# Altium schematic sheet PAGE1 - MAIN.SchDoc
size A3; DocumentNumber: 1; SheetNumber: 1; SheetTotal: 2
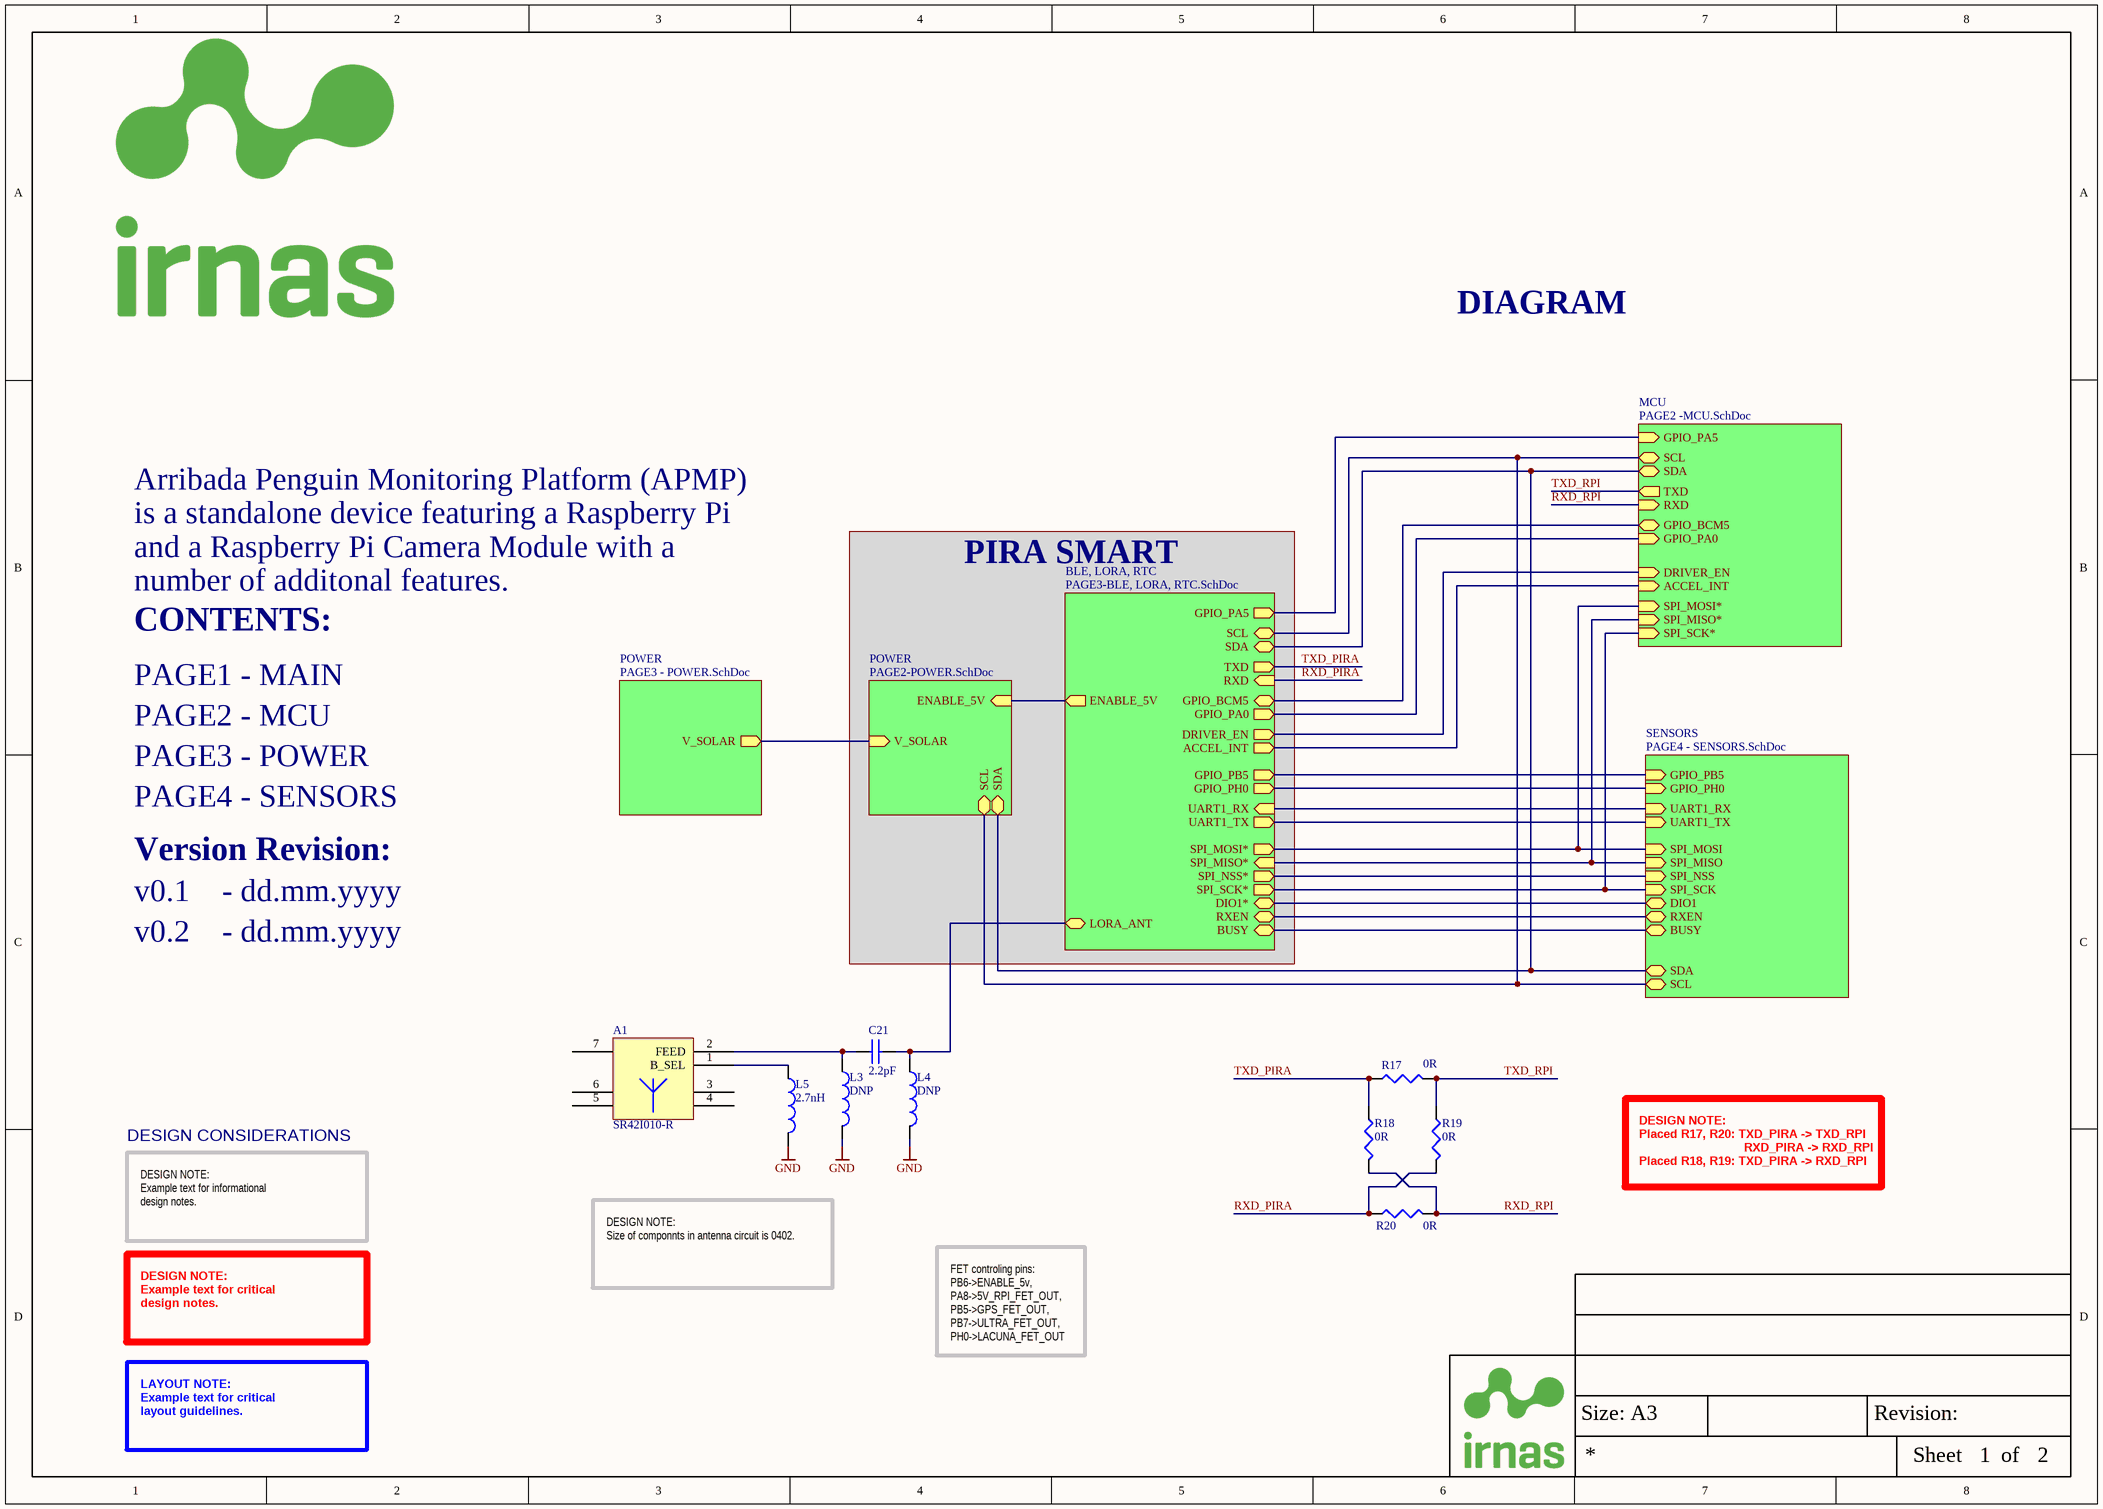
[diagram p0: PAGE1 - MAIN.SchDoc]

## Parts
A1  SR42I010-R  [LORA_PCB_ANTENNA]
C21  2.2pF  [CAP0402]
L3  DNP  [IND0402]
L4  DNP  [IND0402]
L5  2.7nH  [IND0402]
R17  0R  [RES0603]
R18  0R  [RES0603]
R19  0R  [RES0603]
R20  0R  [RES0603]

## Sub-sheets
BLE, LORA, RTC = PAGE3-BLE, LORA, RTC.SchDoc: ENABLE_5V (out), SDA (bidir), UART1_RX (in), SCL (bidir), UART1_TX (out), GPIO_PH0 (out), GPIO_PA5 (out), LORA_ANT (bidir), GPIO_PB5 (out), SPI_MOSI* (out), SPI_MISO* (in), SPI_SCK* (out), DIO1* (bidir), SPI_NSS* (out), TXD (out), RXD (in), GPIO_BCM5 (bidir), RXEN (bidir), BUSY (bidir), GPIO_PA0 (out), DRIVER_EN (out), ACCEL_INT (out)
MCU = PAGE2 -MCU.SchDoc: SDA (bidir), GPIO_PA5 (in), SCL (bidir), TXD (out), GPIO_BCM5 (bidir), RXD (in), GPIO_PA0 (in), DRIVER_EN (in), ACCEL_INT (in), SPI_MISO* (in), SPI_MOSI* (in), SPI_SCK* (in)
POWER = PAGE3 - POWER.SchDoc: V_SOLAR (out)
POWER = PAGE2-POWER.SchDoc: ENABLE_5V (in), SCL (bidir), SDA (bidir), V_SOLAR (in)
SENSORS = PAGE4 - SENSORS.SchDoc: SDA (bidir), GPIO_PH0 (in), UART1_RX (in), SPI_SCK (in), SPI_NSS (in), UART1_TX (in), SCL (bidir), GPIO_PB5 (in), DIO1 (bidir), SPI_MISO (in), SPI_MOSI (in), RXEN (bidir), BUSY (bidir)

## Nets
GND: L3.1 L4.1 L5.1
RXD_PIRA: R19.2 R20.1 ; sheet BLE, LORA, RTC/RXD
RXD_RPI: R18.2 R20.2 ; sheet MCU/RXD
TXD_PIRA: R17.1 R18.1 ; sheet BLE, LORA, RTC/TXD
TXD_RPI: R17.2 R19.1 ; sheet MCU/TXD
NetA1_1: A1.1(B_SEL) L5.2
NetA1_2: A1.2(FEED) C21.1 L3.2
NetC21_2: C21.2 L4.2 ; sheet BLE, LORA, RTC/LORA_ANT
(unnamed): sheet POWER/V_SOLAR, sheet POWER/V_SOLAR
(unnamed): sheet SENSORS/SDA, sheet MCU/SDA, sheet POWER/SDA, sheet BLE, LORA, RTC/SDA
(unnamed): sheet SENSORS/GPIO_PH0, sheet BLE, LORA, RTC/GPIO_PH0
(unnamed): sheet SENSORS/UART1_RX, sheet BLE, LORA, RTC/UART1_RX
(unnamed): sheet SENSORS/SPI_SCK, sheet MCU/SPI_SCK*, sheet BLE, LORA, RTC/SPI_SCK*
(unnamed): sheet SENSORS/SPI_NSS, sheet BLE, LORA, RTC/SPI_NSS*
(unnamed): sheet SENSORS/UART1_TX, sheet BLE, LORA, RTC/UART1_TX
(unnamed): sheet SENSORS/SCL, sheet MCU/SCL, sheet POWER/SCL, sheet BLE, LORA, RTC/SCL
(unnamed): sheet SENSORS/GPIO_PB5, sheet BLE, LORA, RTC/GPIO_PB5
(unnamed): sheet SENSORS/DIO1, sheet BLE, LORA, RTC/DIO1*
(unnamed): sheet SENSORS/SPI_MISO, sheet MCU/SPI_MISO*, sheet BLE, LORA, RTC/SPI_MISO*
(unnamed): sheet SENSORS/SPI_MOSI, sheet MCU/SPI_MOSI*, sheet BLE, LORA, RTC/SPI_MOSI*
(unnamed): sheet SENSORS/RXEN, sheet BLE, LORA, RTC/RXEN
(unnamed): sheet SENSORS/BUSY, sheet BLE, LORA, RTC/BUSY
(unnamed): sheet MCU/GPIO_PA5, sheet BLE, LORA, RTC/GPIO_PA5
(unnamed): sheet MCU/GPIO_BCM5, sheet BLE, LORA, RTC/GPIO_BCM5
(unnamed): sheet MCU/GPIO_PA0, sheet BLE, LORA, RTC/GPIO_PA0
(unnamed): sheet MCU/DRIVER_EN, sheet BLE, LORA, RTC/DRIVER_EN
(unnamed): sheet MCU/ACCEL_INT, sheet BLE, LORA, RTC/ACCEL_INT
(unnamed): sheet POWER/ENABLE_5V, sheet BLE, LORA, RTC/ENABLE_5V

Not connected (* = marked no-connect by the designer): A1 3 4 5 6 7

## Notes on the sheet
- DIAGRAM
- Arribada Penguin Monitoring Platform (APMP)
- is a standalone device featuring a Raspberry Pi
- and a Raspberry Pi Camera Module with a
- PIRA SMART
- CONTENTS:
- number of additonal features.
- PAGE1 - MAIN
- PAGE2 - MCU
- PAGE3 - POWER
- PAGE4 - SENSORS
- Version Revision:
- v0.1    - dd.mm.yyyy
- v0.2    - dd.mm.yyyy
- DESIGN CONSIDERATIONS
- DESIGN NOTE:
  Placed R17, R20: TXD_PIRA -> TXD_RPI
  RXD_PIRA -> RXD_RPI
  Placed R18, R19: TXD_PIRA -> RXD_RPI
  RXD_PIRA -> TXD_RPI
- DESIGN NOTE:
  Example text for informational
  design notes.
- DESIGN NOTE:
  Example text for critical
  design notes.
- DESIGN NOTE:
  Size of componnts in antenna circuit is 0402.
- FET controling pins:
  PB6->ENABLE_5v,
  PA8->5V_RPI_FET_OUT,
  PB5->GPS_FET_OUT,
  PB7->ULTRA_FET_OUT,
  PH0->LACUNA_FET_OUT
- LAYOUT NOTE:
  Example text for critical
  layout guidelines.
- Size: A3
- Revision:
- Sheet
- of

## Library data of the parts
A1 = ANT - SR42I010-R_1: Antenna SMD -4dBi Gain 870MHz/928MHz Automotive 7-Pin SMD T/R; Manufacturer: Antenova; Supplier 1: Mouser; Manufacturer Part Number: SR42I010-R; Stock 1: 3154; Pricing 1: 1 = 2.36000, 10 = 1.90000, 50 = 1.90000, 100 = 1.52000, 1000 = 1.07000, 10000 = 0.95900 (USD); Supplier Part Number 1: 237-SR42I010-R
C21 = C - 1.8pF/0402: Multilayer Ceramic Capacitors MLCC - SMD/SMT 50volts 1.8pF C0G; Manufacturer: KEMET; Manufacturer Part Number: C0402C189B5GACTU; IRNAS Part No.: /; Voltage Rating: 50V; Stock 1: 8950; Pricing 1: 10=0.463, 100=0.248, 500=0.182, 2500=0.153, 5000=0.134, 10000=0.11, 50000=0.0961 (EUR); Case/Package: 0402; Case Code (Imperial): 0402; Case Code (Metric): 1005; Dielectric Material: Ceramic; Min Operating Temperature: -55°C; Max Operating Temperature: 125°C; Packaging: Tape and Reel; Voltage Rating (DC): 50V; Capacitance: 1.8pF; Termination: SMD/SMT; Lead Free: Lead Free; ComponentLink1URL: https://datasheet.ciiva.com/5413/kem-c1003-c0g-smd-5413366.pdf; ComponentLink1Description: https://datasheet.ciiva.com/5413/kem-c1003-c0g-smd-5413366.pdf; Supplier 1: Farnell; Supplier Part Number 1: 2627398
L3-L5 = L - 4.3nH/0402: Inductor RF Chip Multi-Layer 4.3nH 0.3nH 100MHz 8Q-Factor Air 300mA 210mOhm DCR 0402 Paper T/R; Manufacturer: Murata; Manufacturer Part Number: LQG15HN4N3S02D; IRNAS Part No.: /; Q Factor: 8; Self Resonant Frequency: 6GHz; Shielding: Unshielded; DC Resistance (DCR): 210mR; Stock 1: 3502; Pricing 1: 1 = 0.10000, 10 = 0.06100, 100 = 0.04040, 500 = 0.03366, 1000 = 0.02827, 2500 = 0.02423 (USD); RoHS: Yes; Mount: Surface Mount; Case/Package: 0402; Core Material: Air; Case Code (Metric): 1005; Case Code (Imperial): 0402; Min Operating Temperature: -55°C; Max Operating Temperature: 125°C; Package Quantity: 10000; Packaging: Tape and Reel; Current Rating: 300mA; Inductance: 4.3nh; Test Frequency: 100MHz; Max DC Current: 300mA; Termination: SMD/SMT; Current: 300mA; DC Current: 300mA; Military Standard: Not; Length: 1.05mm; Height: 0.5mm; Width: 0.02inch; Height - Seated (Max): 0.022inch; Depth: 0.55mm; Radiation Hardening: No; REACH SVHC: No SVHC; Lead Free: Lead Free; ComponentLink1URL: http://uk.rs-online.com/webdocs/0f10/0900766b80f10808.pdf?src-supplier=RSComponents; ComponentLink1Description: http://uk.rs-online.com/webdocs/0f10/0900766b80f10808.pdf?src-supplier=RSComponents; ComponentLink2URL: http://search.murata.co.jp/Ceramy/image/img/PDF/ENG/L0075S0083LQG15HN.pdf?src-supplier=Avnet; ComponentLink2Description: http://search.murata.co.jp/Ceramy/image/img/PDF/ENG/L0075S0083LQG15HN.pdf?src-supplier=Avnet; ComponentLink3URL: http://www.farnell.com/datasheets/66026.pdf?src-supplier=Element14; ComponentLink3Description: http://www.farnell.com/datasheets/66026.pdf?src-supplier=Element14; ComponentLink4URL: https://www.verical.com/server-webapp/html/getDatasheet?partID=31252&src-supplier=Verical; ComponentLink4Description: https://www.verical.com/server-webapp/html/getDatasheet?partID=31252&src-supplier=Verical; ComponentLink5URL: http://search.murata.co.jp/Ceramy/image/img/PDF/ENG/L0075S0083LQG15HN.pdf?src-supplier=Avnet+Europe; ComponentLink5Description: http://search.murata.co.jp/Ceramy/image/img/PDF/ENG/L0075S0083LQG15HN.pdf?src-supplier=Avnet+Europe; ComponentLink6URL: https://search.murata.co.jp/Ceramy/image/img/P02/partnumberingAT_LQ3E.pdf?src-supplier=Digi-Key; ComponentLink6Description: https://search.murata.co.jp/Ceramy/image/img/P02/partnumberingAT_LQ3E.pdf?src-supplier=Digi-Key; Supplier 1: Farnell
  L3 L4: Supplier Part Number 1: 1711735
  L5: Supplier Part Number 1: 1343066
R17-R20 = R - 0R: BOURNS - CR0603-J/-000ELF - RES, THICK FILM, 0R, 5%, 0.1W, 0603; IRNAS Part No.: I-100011; Resistance: 0; Voltage Rating: 50; Resistor Case Style: 0603 [1608 Metric]; Power Rating: 100; Product Range: CR Series; SVHC: No SVHC (17-Dec-2015); Resistor Mounting: Surface Mount Device<!--FANDB--><div class="features-and-benefits-container"><div class="features-and-benefits-description"><span class="features-benefits-value">The Bourns CR series are standard thick film chip resistors. These resistors provide flexibility of performance, space saving and low cost. The Resistance range includes E96 and E24 decade values from 1ohm to 10Mohm.</span></div><div class="features-and-benefits-list"><ul class="features-and-benefits-list-list"><li class="features-and-benefits-list-item">0201, 0402, 0603, 0805, 1206, 1210, 2010, 2512 standard case sizes available</li><li class="features-and-benefits-list-item">±1% and ±5% tolerance</li><li class="features-and-benefits-list-item">±100ppm/°C, ±200ppm/°C and ±250ppm/°C TCR values available</li><li class="features-and-benefits-list-item">Power rating selectable for 50mW, 63mW, 0.1W, 0.125W, 0.25W, 0.5W and 1W based on ordering</li><li class="features-and-benefits-list-item">Jumpers are available for all size</li><li class="features-and-benefits-list-item">3 layer termination process with nickel barrier prevents leaching & provides excellent solderability</li><li class="features-and-benefits-list-item">Suitable for all type of soldering processes</li><li class="features-and-benefits-list-item">Tight dimensional tolerances</li><li class="features-and-benefits-list-item">Maximum working voltage depends on case size</li><li class="features-and-benefits-list-item">Operating temperature of -55°C to +125°C(CR0201) and -55°C to +155; Supplier 1: Farnell; Manufacturer: BOURNS; Manufacturer Part Number: CR0603-J/-000ELF; RoHS: YES; Stock 1: 58200; Pricing 1: 10=0.0146, 250=0.0097, 1000=0.0073, 5000=0.0049, 12500=0.0042 (GBP); Resistance Tolerance: ± 5%; Packaging: Cut Tape; Resistor Element Material: Thick Film; Temperature Coefficient: -; Automotive Qualification Standard: -; MSL: MSL 1 - Unlimited; ComponentLink1URL: http://www.bourns.com/engineering/CHPREZTR/cr0603.stp; ComponentLink1Description: http://www.bourns.com/engineering/CHPREZTR/cr0603.stp; ComponentLink2URL: http://www.farnell.com/datasheets/2178762.pdf; ComponentLink2Description: http://www.farnell.com/datasheets/2178762.pdf; Supplier Part Number 1: 2008343